# Altium schematic sheet 7-seg-thermometer-basic.SchDoc
size A
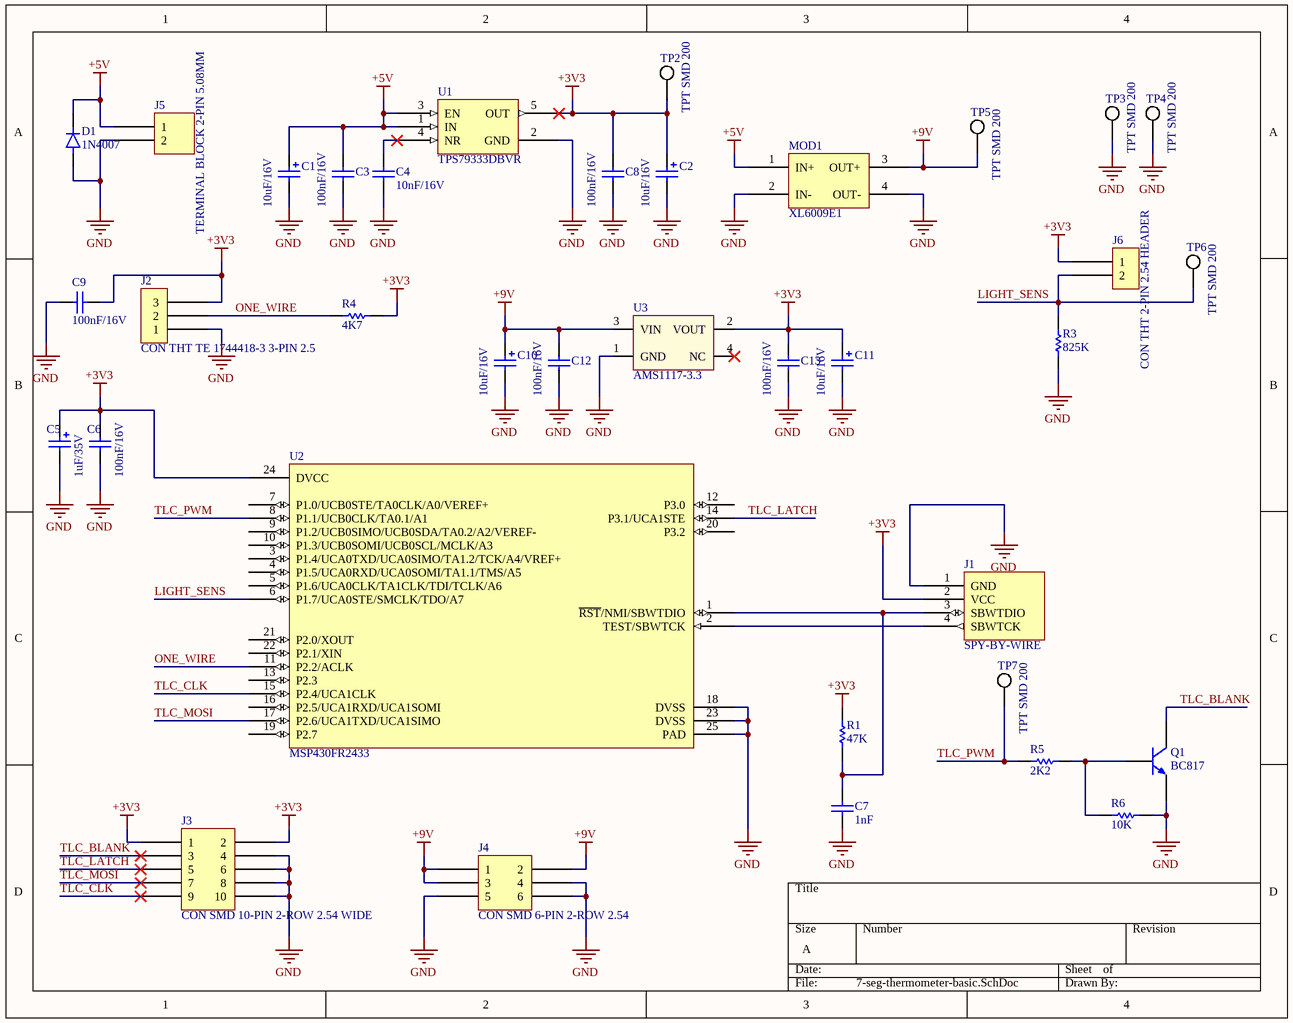
[diagram p0: 7-seg-thermometer-basic.SchDoc]

## Parts
C1  10uF/16V  [SMD 1206 POLARIZED]
C2  10uF/16V  [SMD 1206 POLARIZED]
C3  100nF/16V  [SMD 0603 GENERIC]
C4  10nF/16V  [SMD 0603 GENERIC]
C5  1uF/35V  [SMD 1206 POLARIZED]
C6  100nF/16V  [SMD 0603 GENERIC]
C7  1nF  [SMD 0603 GENERIC]
C8  100nF/16V  [SMD 0603 GENERIC]
C9  100nF/16V  [SMD 0603 GENERIC]
C10  10uF/16V  [SMD 1206 POLARIZED]
C11  10uF/16V  [SMD 1206 POLARIZED]
C12  100nF/16V  [SMD 0603 GENERIC]
C13  100nF/16V  [SMD 0603 GENERIC]
D1  1N4007  [THT DO-41]
J1  SPY-BY-WIRE  [THT CON 4-PIN 2.54 WHITE]
J2  CON THT TE 1744418-3 3-PIN 2.5  [THT CON TE 1744418-3 2.5]
J3  CON SMD 10-PIN 2-ROW 2.54 WIDE  [SMD HEADER 2x5 2.54 WIDE]
J4  CON SMD 6-PIN 2-ROW 2.54  [SMD HEADER 2x3 2.54]
J5  TERMINAL BLOCK 2-PIN 5.08MM  [THT CON 2-PIN 5.08]
J6  CON THT 2-PIN 2.54 HEADER  [THT CON 2-PIN 2.54]
MOD1  XL6009E1  [THT MOD XL6009E1]
Q1  BC817  [SOT23-3]
R1  47K  [SMD 0603 GENERIC]
R3  825K  [SMD 0603 GENERIC]
R4  4K7  [SMD 0603 GENERIC]
R5  2K2  [SMD 0805 GENERIC]
R6  10K  [SMD 0805 GENERIC]
TP2  TPT SMD 200  [SMD TP 2.0mm]
TP3  TPT SMD 200  [SMD TP 2.0mm]
TP4  TPT SMD 200  [SMD TP 2.0mm]
TP5  TPT SMD 200  [SMD TP 2.0mm]
TP6  TPT SMD 200  [SMD TP 2.0mm]
TP7  TPT SMD 200  [SMD TP 2.0mm]
U1  TPS79333DBVR  [SOT23-5]
U2  MSP430FR2433  [VQFN-24]
U3  AMS1117-3.3  [SOT-223]

## Nets
+3V3: C2.1 C5.1 C6.2 C8.2 C9.2 C11.1 C13.2 J1.2(VCC) J2.3 J3.1 J3.2 J6.1 R1.2 R4.2 TP2.1 U1.5(OUT) U2.24(DVCC) U3.2(VOUT)
+5V: C1.1 C3.2 D1.K J5.1 MOD1.1(IN+) U1.1(IN) U1.3(EN)
+9V: C10.1 C12.2 J4.1 J4.2 J4.3 MOD1.3(OUT+) TP5.1 U3.3(VIN)
GND: C1.2 C2.2 C3.1 C4.1 C5.2 C6.1 C7.1 C8.1 C9.1 C10.2 C11.2 C12.1 C13.1 D1.A J1.1(GND) J2.1 J3.4 J3.6 J3.8 J3.10 J4.4 J4.5 J4.6 J5.2 MOD1.2(IN-) MOD1.4(OUT-) Q1.2(Emitter) R3.1 R6.1 TP3.1 TP4.1 U1.2(GND) U2.18(DVSS) U2.23(DVSS) U2.25(PAD) U3.1(GND)
LIGHT_SENS: J6.2 R3.2 TP6.1 U2.6(P1.7/UCA0STE/SMCLK/TDO/A7)
ONE_WIRE: J2.2 R4.1 U2.11(P2.2/ACLK)
TLC_BLANK: J3.3 Q1.3(Collector)
TLC_CLK: J3.9 U2.15(P2.4/UCA1CLK)
TLC_LATCH: J3.5 U2.14(P3.1/UCA1STE)
TLC_MOSI: J3.7 U2.17(P2.6/UCA1TXD/UCA1SIMO)
TLC_PWM: R5.1 TP7.1 U2.8(P1.1/UCB0CLK/TA0.1/A1)
NetC4_2: C4.2 U1.4(NR)
NetC7_2: C7.2 J1.3(SBWTDIO) R1.1 U2.1(~{RST}/NMI/SBWTDIO)
NetJ1_4: J1.4(SBWTCK) U2.2(TEST/SBWTCK)
NetQ1_1: Q1.1(Base) R5.2 R6.2

Not connected (* = marked no-connect by the designer): U2 3(P1.4/UCA0TXD/UCA0SIMO/TA1.2/TCK/A4/VREF+) 4(P1.5/UCA0RXD/UCA0SOMI/TA1.1/TMS/A5) 5(P1.6/UCA0CLK/TA1CLK/TDI/TCLK/A6) 7(P1.0/UCB0STE/TA0CLK/A0/VEREF+) 9(P1.2/UCB0SIMO/UCB0SDA/TA0.2/A2/VEREF-) 10(P1.3/UCB0SOMI/UCB0SCL/MCLK/A3) 12(P3.0) 13(P2.3) 16(P2.5/UCA1RXD/UCA1SOMI) 19(P2.7) 20(P3.2) 21(P2.0/XOUT) 22(P2.1/XIN); U3 4(NC)*

## Library data of the parts
C1 C2 C10 C11 = CAP SMD TAN 10uF 16V 10% 1206
C3 C6 C8 C9 C12 C13 = CAP SMD CER 100nF 16V 10% X7R 0603
C4 = CAP SMD CER 10nF 16V 10% X7R 0603
C5 = CAP SMD TAN 1uF 35V 10% 1206
C7 = CAP SMD CER 1nF 16V 10% X7R 0603
D1 = SEM GEN 1000V 1A DO-41 1N4007
J1 = CON THT SPY-BY-WIRE 4-PIN 2.54
J3 = CON SMD 10-PIN 2-ROW 2.54 WIDE: HTST-105-01-SM-DV-P
J5 = CON THT TERMINAL BLOCK  2-PIN 5.08: 282841-2
MOD1 = MOD XL6009E1
Q1 = SEM BJT NPN 45V 500mA BC817
R1 = RES SMD 47K 1% 0603
R3 = RES SMD 825K 1% 0603
R4 = RES SMD 4K7 1% 0603
R5 = RES SMD 2K2 1% 0805
R6 = RES SMD 10K 1% 0805
U1 = PWR TPS79333DBVR
U2 = MCU MSP430FR2433IRGET
U3 = PWR AMS1117-3.3 1A LDO